# Altium schematic sheet schematic.SchDoc
size A4; SheetNumber: 1; SheetTotal: 1
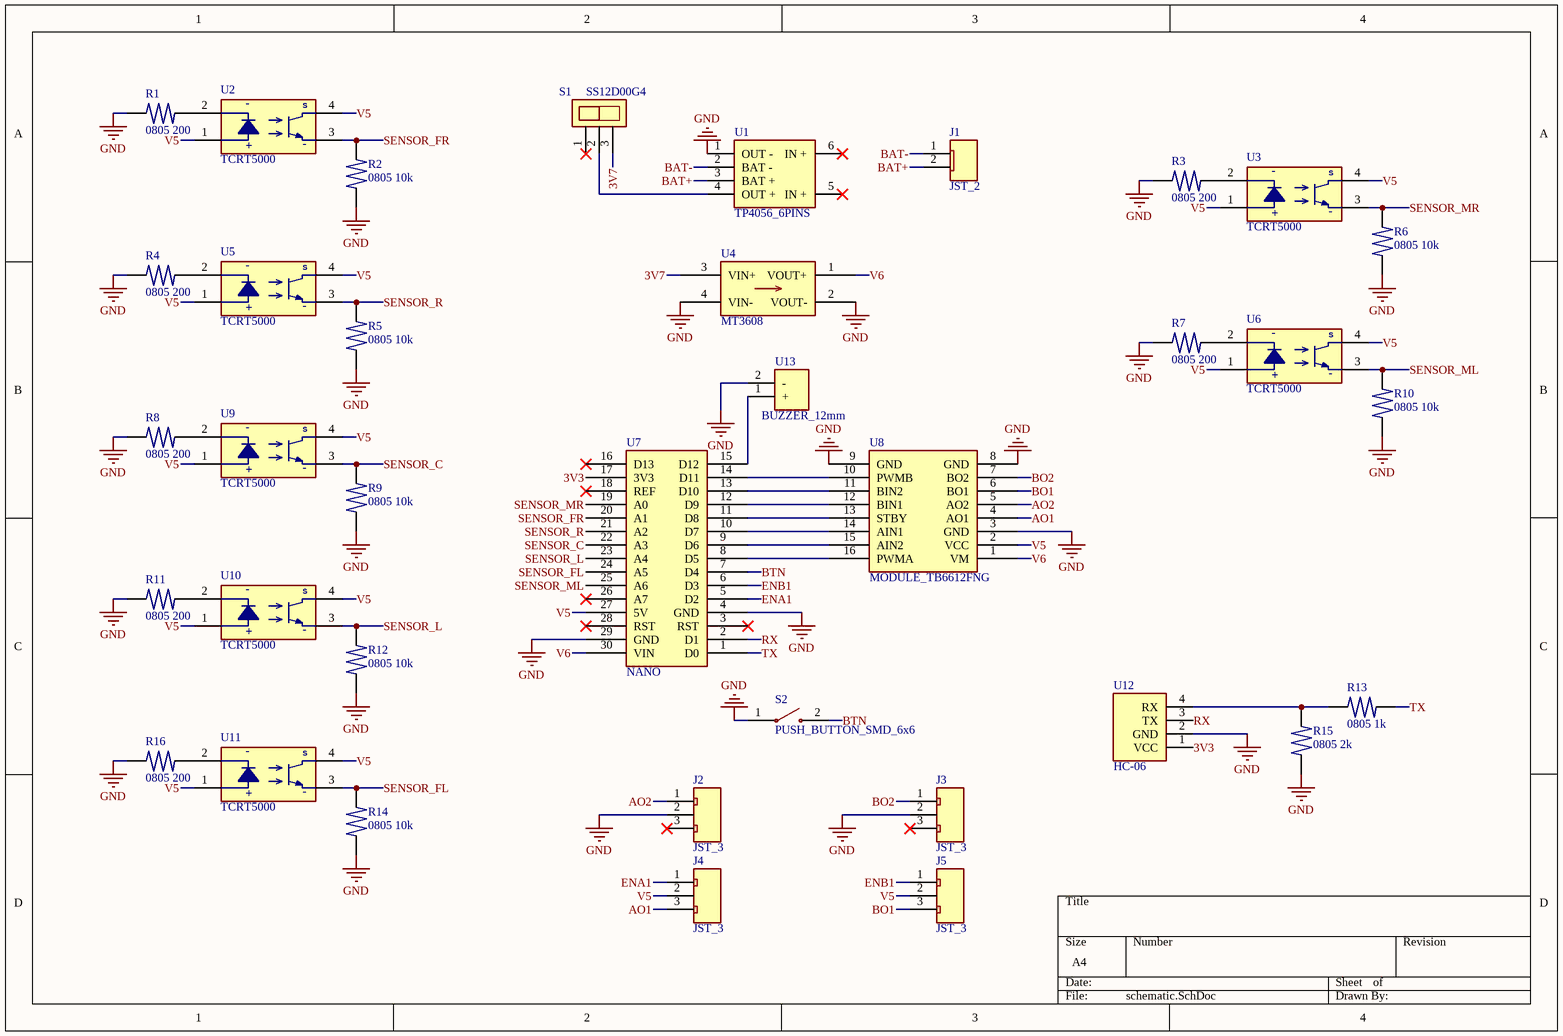
[diagram p0: schematic.SchDoc]

## Parts
J1  JST_2  [JST_2]
J2  JST_3  [JST_3]
J3  JST_3  [JST_3]
J4  JST_3  [JST_3]
J5  JST_3  [JST_3]
R1  0805 200  [RESISTOR_0805]
R2  0805 10k  [RESISTOR_0805]
R3  0805 200  [RESISTOR_0805]
R4  0805 200  [RESISTOR_0805]
R5  0805 10k  [RESISTOR_0805]
R6  0805 10k  [RESISTOR_0805]
R7  0805 200  [RESISTOR_0805]
R8  0805 200  [RESISTOR_0805]
R9  0805 10k  [RESISTOR_0805]
R10  0805 10k  [RESISTOR_0805]
R11  0805 200  [RESISTOR_0805]
R12  0805 10k  [RESISTOR_0805]
R13  0805 1k  [RESISTOR_0805]
R14  0805 10k  [RESISTOR_0805]
R15  0805 2k  [RESISTOR_0805]
R16  0805 200  [RESISTOR_0805]
S1  SS12D00G4  [SS12D00G4]
S2  PUSH_BUTTON_SMD_6x6  [PUSH_BUTTON_SMD_6x6]
U1  TP4056_6PINS  [TP4056_6PINs]
U2  TCRT5000  [TCRT5000]
U3  TCRT5000  [TCRT5000]
U4  MT3608  [MT3608]
U5  TCRT5000  [TCRT5000]
U6  TCRT5000  [TCRT5000]
U7  NANO  [NANO]
U8  MODULE_TB6612FNG  [MODULE_TB6612FNG]
U9  TCRT5000  [TCRT5000]
U10  TCRT5000  [TCRT5000]
U11  TCRT5000  [TCRT5000]
U12  HC-06  [HC-06]
U13  BUZZER_12mm  [BUZZER_12mm]

## Nets
GND: J2.2 J3.2 R1.1 R2.1 R3.1 R4.1 R5.1 R6.1 R7.1 R8.1 R9.1 R10.1 R11.1 R12.1 R14.1 R15.1 R16.1 S2.1 U1.1(OUT_-) U4.2(VOUT-) U4.4(VIN-) U7.4(GND) U7.29(GND) U8.3(GND) U8.8(GND) U8.9(GND) U12.2(GND) U13.2(-)
3V3: U7.17(3V3) U12.1(VCC)
3V7: S1.3 U4.3(VIN+)
AO1: J4.3 U8.4(AO1)
AO2: J2.1 U8.5(AO2)
BAT+: J1.2 U1.3(BAT_+)
BAT-: J1.1 U1.2(BAT_-)
BO1: J5.3 U8.6(BO1)
BO2: J3.1 U8.7(BO2)
BTN: S2.2 U7.7(D4)
ENA1: J4.1 U7.5(D2)
ENB1: J5.1 U7.6(D3)
RX: U7.2(D1) U12.3(TX)
SENSOR_C: R9.2 U7.22(A3) U9.3(GND)
SENSOR_FL: R14.2 U7.24(A5) U11.3(GND)
SENSOR_FR: R2.2 U2.3(GND) U7.20(A1)
SENSOR_L: R12.2 U7.23(A4) U10.3(GND)
SENSOR_ML: R10.2 U6.3(GND) U7.25(A6)
SENSOR_MR: R6.2 U3.3(GND) U7.19(A0)
SENSOR_R: R5.2 U5.3(GND) U7.21(A2)
TX: R13.2 U7.1(D0)
V5: J4.2 J5.2 U2.1(VCC) U2.4(SIGNAL) U3.1(VCC) U3.4(SIGNAL) U5.1(VCC) U5.4(SIGNAL) U6.1(VCC) U6.4(SIGNAL) U7.27(5V) U8.2(VCC) U9.1(VCC) U9.4(SIGNAL) U10.1(VCC) U10.4(SIGNAL) U11.1(VCC) U11.4(SIGNAL)
V6: U4.1(VOUT+) U7.30(VIN) U8.1(VM)
NetR1_2: R1.2 U2.2(GND)
NetR3_2: R3.2 U3.2(GND)
NetR4_2: R4.2 U5.2(GND)
NetR7_2: R7.2 U6.2(GND)
NetR8_2: R8.2 U9.2(GND)
NetR11_2: R11.2 U10.2(GND)
NetR13_1: R13.1 R15.2 U12.4(RX)
NetR16_2: R16.2 U11.2(GND)
NetS1_2: S1.2 U1.4(OUT_+)
NetU7_8: U7.8(D5) U8.16(PWMA)
NetU7_9: U7.9(D6) U8.15(AIN2)
NetU7_10: U7.10(D7) U8.14(AIN1)
NetU7_11: U7.11(D8) U8.13(STBY)
NetU7_12: U7.12(D9) U8.12(BIN1)
NetU7_13: U7.13(D10) U8.11(BIN2)
NetU7_14: U7.14(D11) U8.10(PWMB)
NetU7_15: U7.15(D12) U13.1(+)

Not connected (* = marked no-connect by the designer): J2 3*; J3 3*; S1 1*; U1 5(IN_+)* 6(IN_+)*; U7 3(RST)* 16(D13)* 18(REF)* 26(A7)* 28(RST)*

## Notes on the sheet
- (in symbol TCRT5000) -; S; +

## Library data of the parts
R1-R16 = RESISTOR_0805
U1 = TP4056_6PINS: MODULE BATTERY CHARGER 6 PINS
U2 U3 U5 U6 U9-U11 = TCRT5000: REFLECTIVE OPTICAL SENSOR PTH; Mouser PN: 782-TCRT5000; ComponentLink1Description: Datasheet; ComponentLink1URL: https://br.mouser.com/datasheet/2/427/tcrt5000-1767618.pdf
U4 = MT3608: MODULE BUCK STEP UP 2A 37x17mm
U7 = NANO: Microcontroller Board ATMEGA328P 30 Pins; ComponentLink1Description: Datasheet; ComponentLink1URL: https://ww1.microchip.com/downloads/en/DeviceDoc/Atmel-7810-Automotive-Microcontrollers-ATmega328P_Datasheet.pdf
U8 = MODULE_TB6612FNG: Module Dual Motor Driver 2.5-13.5V 3.2A Peak 21x18mm; ComponentLink1Description: Datasheet; ComponentLink1URL: https://www.mouser.com/datasheet/2/408/TB6612FNG_datasheet_en_20141001-708260.pdf
U12 = HC-06: BLUETOOTH MODULE
U13 = BUZZER_12mm: BUZZER MAGNETIC 12MM; Digikey PN: 433-WT-1209T-ND; Mouser PN: 433-WT-1209T-ND
S2 = PUSH_BUTTON_SMD_6X6: Mouser PN: 611-KSC251JLFS